# Altium schematic sheet ADC-RDC-PHY.SchDoc
size A4
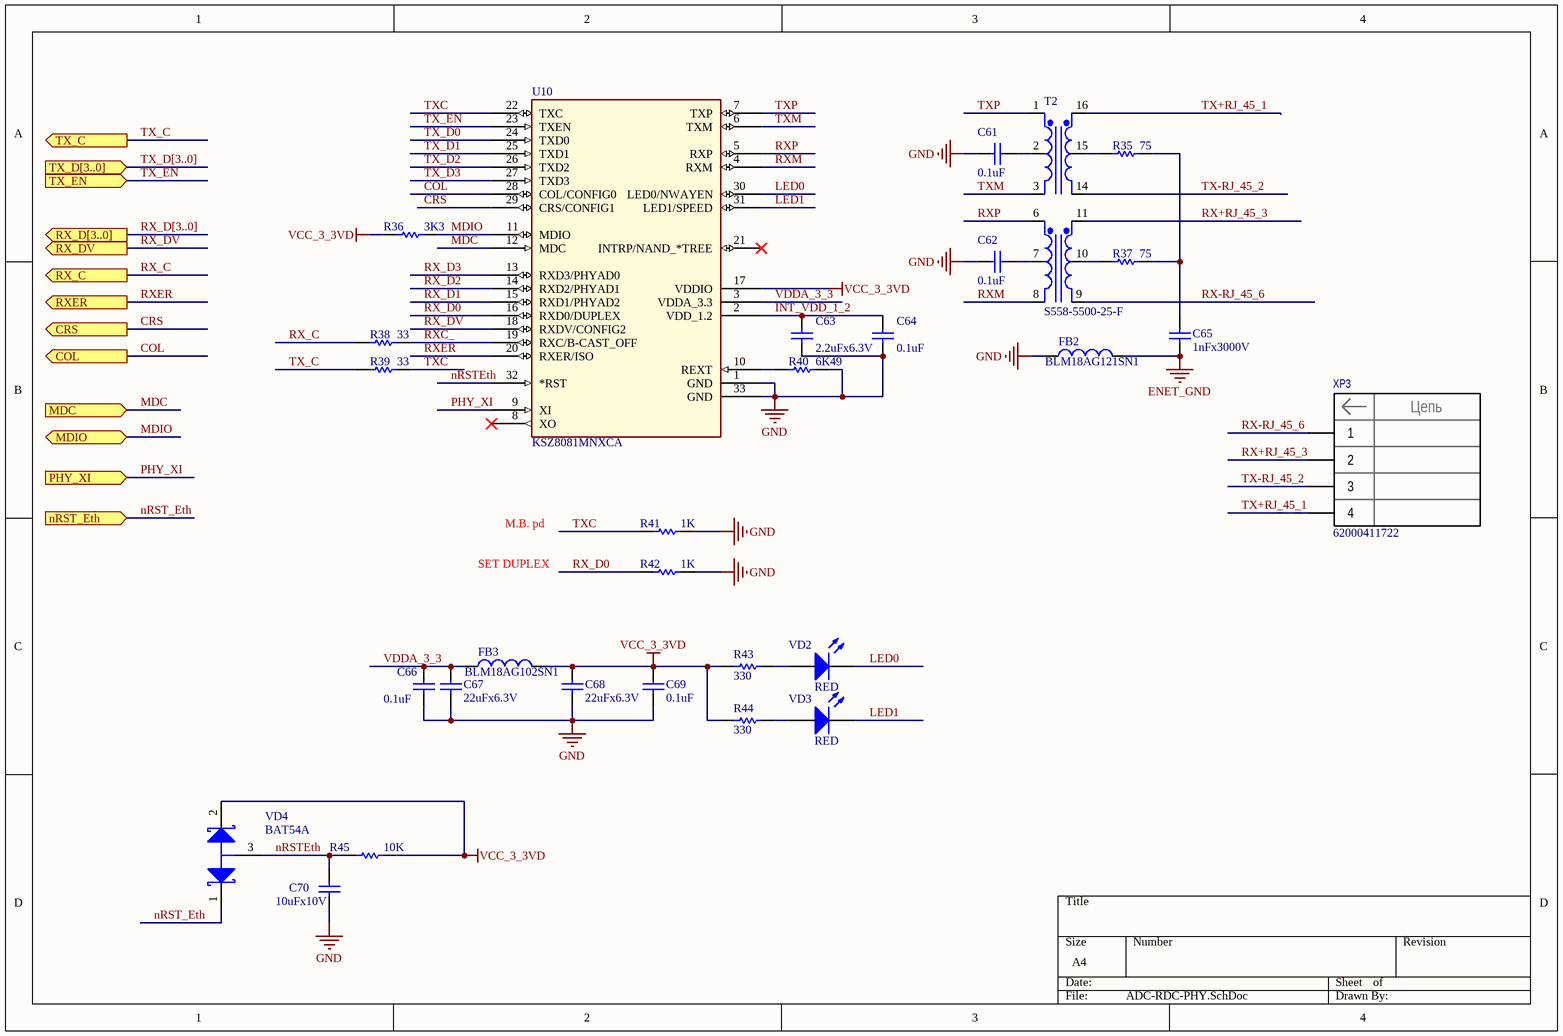
[diagram p0: ADC-RDC-PHY.SchDoc]

## Parts
C61  0.1uF  [C0603]
C62  0.1uF  [C0603]
C63  2.2uFx6.3V  [C0603]
C64  0.1uF  [C0603]
C65  1nFx3000V  [C1808]
C66  0.1uF  [C0603]
C67  22uFx6.3V  [C0805]
C68  22uFx6.3V  [C0805]
C69  0.1uF  [C0603]
C70  10uFx10V  [C0805]
FB2  BLM18AG121SN1  [R0603]
FB3  BLM18AG102SN1  [R0603]
R35  75  [R0603]
R36  3K3  [R0603]
R37  75  [R0603]
R38  33  [R0603]
R39  33  [R0603]
R40  6K49  [R0603]
R41  1K  [R0603]
R42  1K  [R0603]
R43  330  [R0603]
R44  330  [R0603]
R45  10K  [R0603]
T2  S558-5500-25-F  [N5]
U10  KSZ8081MNXCA  [QFN32_L]
VD2  RED  [D0805]
VD3  RED  [D0805]
VD4  BAT54A  [SOT-23]
XP3  Component_name: 62000411722  [conP_WR-WTB_62000411722-4pin_P2000_100x76x48_L]  (hidden comment: plug_62000411722_WR-WTB_4pin_horiz)

## Ports
COL (out), CRS (out), MDC (in), MDIO (bidir), nRST_Eth (in), PHY_XI (in), RX_C (out), RX_D[3..0] (out), RX_DV (out), RXER (out), TX_C (out), TX_D[3..0] (in), TX_EN (in)

## Nets
ENET_GND: C65.2 FB2.1
GND: C61.2 C62.2 C63.2 C64.1 C66.1 C67.1 C68.1 C69.1 C70.2 FB2.2 R40.2 R41.2 R42.2 U10.1(GND) U10.33(GND)
VCC_3_3VD: C68.2 C69.2 FB3.1 R36.1 R43.2 R44.2 R45.2 U10.17(VDDIO) VD4.2(A2)
COL: U10.28(COL/CONFIG0) ; port COL
CRS: U10.29(CRS/CONFIG1) ; port CRS
INT_VDD_1_2: C63.1 C64.2 U10.2(VDD_1.2)
LED0: U10.30(LED0/NWAYEN) VD2.2(K)
LED1: U10.31(LED1/SPEED) VD3.2(K)
MDC: U10.12(MDC) ; port MDC
MDIO: R36.2 U10.11(MDIO) ; port MDIO
nRST_Eth: VD4.1(A1) ; port nRST_Eth
nRSTEth: C70.1 R45.1 U10.32(*RST) VD4.3(K)
PHY_XI: U10.9(XI) ; port PHY_XI
RX+RJ_45_3: T2.11(Pri2+) XP3.2
RX-RJ_45_6: T2.9(Pri2-) XP3.1
RX_C: R38.1 ; port RX_C
RX_D0: R42.1 U10.16(RXD0/DUPLEX)
RX_D1: U10.15(RXD1/PHYAD2)
RX_D2: U10.14(RXD2/PHYAD1)
RX_D3: U10.13(RXD3/PHYAD0)
RX_DV: U10.18(RXDV/CONFIG2) ; port RX_DV
RXC_: R38.2 U10.19(RXC/B-CAST_OFF)
RXER: U10.20(RXER/ISO) ; port RXER
RXM: T2.8(Sec2-) U10.4(RXM)
RXP: T2.6(Sec2+) U10.5(RXP)
TX+RJ_45_1: T2.16(Pri1+) XP3.4
TX-RJ_45_2: T2.14(Pri1-) XP3.3
TX_C: R39.1 ; port TX_C
TX_D0: U10.24(TXD0)
TX_D1: U10.25(TXD1)
TX_D2: U10.26(TXD2)
TX_D3: U10.27(TXD3)
TX_EN: U10.23(TXEN) ; port TX_EN
TXC: R39.2 R41.1 U10.22(TXC)
TXM: T2.3(Sec1-) U10.6(TXM)
TXP: T2.1(Sec1+) U10.7(TXP)
VDDA_3_3: C66.2 C67.2 FB3.2 U10.3(VDDA_3.3)
NetC61_1: C61.1 T2.2(Sec1CT)
NetC62_1: C62.1 T2.7(Sec2CT)
NetC65_1: C65.1 R35.2 R37.2
NetR35_1: R35.1 T2.15(Pri1CT)
NetR37_1: R37.1 T2.10(Pri2CT)
NetR40_1: R40.1 U10.10(REXT)
NetR43_1: R43.1 VD2.1(A)
NetR44_1: R44.1 VD3.1(A)

Not connected (* = marked no-connect by the designer): U10 8(XO)* 21(INTRP/NAND_*TREE)*

## Buses and harness runs
bus RX_D[3..0] = port RX_D[3..0]
bus TX_D[3..0] = port TX_D[3..0]

## Notes on the sheet
- SET DUPLEX
- M.B. pd
- (in symbol plug_62000411722_WR-WTB_4pin_horiz) Цепь

## Library data of the parts
C61-C70 = Cap: Capacitor, 2pin; ValueSCH: *; ValueBOM: *; MarkPCB: *
FB2 FB3 = Inductor: Inductor, 2pin; ValueSCH: *; ValueBOM: *; MarkPCB: *
R35-R45 = RES: Resistor, 2pin; ValueSCH: *; ValueBOM: *; MarkPCB: *
T2 = TG110-E050N5: Center-Tapped Transformer (Ideal); ValueSCH: *; MarkPCB: *
U10 = KSZ8081MNXCA: 10BASE-T/100BASE-TX Physical Layer Transceiver; ValueBOM: *; ValueSCH: *
VD2 VD3 = LED: Typical GaAs LED; ValueSCH: *; ValueBOM: *; MarkPCB: *
VD4 = BAT54A: Schottky Barrier Double Diode; ValueSCH: *; ValueBOM: *; MarkPCB: *
XP3 = plug_62000411722_WR-WTB_4pin_horiz: 2.00mm Male Vertical Shrouded Header WR-WTB; Part_number_PROSA: D-VI-6034; Manufacturer: "Wurth Elektronik"; LxWxH(mm): 10,0x7,6x4,8; Area(mm2): 76; Number_of_pads: 4; Mounting_type: Standard; Component_ID: plug_62000411722_WR-WTB_4pin_horiz; Component Class: Plug_PCB_mounting; Type: Вилки; PROSA_name (Old name): 62000411722; Package: conP_WR-WTB_62000411722-4pin_P2000_100x76x48; Case_code: WR-WTB_4pin_horiz; Height(mm): 4,8; ComponentLink1Description: plug_62000411722.pdf; ComponentLink1URL: C:\chkout_AltiumLib\Datasheets\Electromechanics_datasheet\Connectors\plug_62000411722.pdf; HelpURL: C:\chkout_AltiumLib\Datasheets\Electromechanics_datasheet\Connectors\plug_62000411722.pdf; ComponentLink2Description: plug_62000411722_URL_Link; ComponentLink2URL: http://katalog.we-online.de/en/em/WTB_2_00_MALE_VERTICAL_SHROUDED_HEADER_6200XX11622